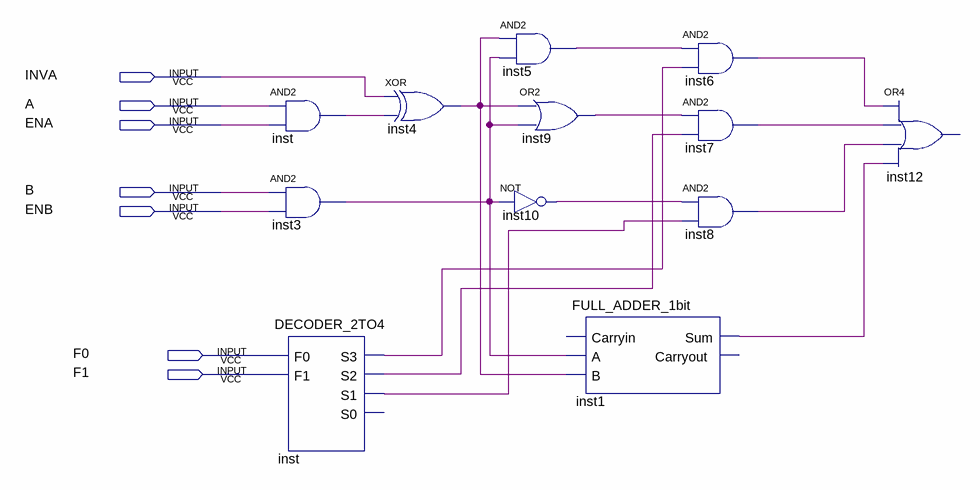
[diagram p0: schematic sheet]
// Quartus schematic ULA_1_BIT.bdf as structural Verilog: 12 symbols, 7 pins
module ULA_1_BIT (
  input  INVA,
  input  A,
  input  ENA,
  input  B,
  input  ENB,
  input  F0,
  input  F1
);

  wire inst1_sum, inst3_out, inst4_out, inst5_out, inst6_out, inst7_out, inst8_out, inst9_out, inst10_out,
       inst_out, inst_s1, inst_s2, inst_s3;

  and inst (inst_out, A, ENA);
  and inst3 (inst3_out, B, ENB);
  DECODER_2TO4 inst_dup2 (.F0(F0), .F1(F1), .S3(inst_s3), .S2(inst_s2), .S1(inst_s1));  // open: S0
  xor inst4 (inst4_out, INVA, inst_out);
  and inst5 (inst5_out, inst4_out, inst3_out);
  or inst9 (inst9_out, inst4_out, inst3_out);
  not inst10 (inst10_out, inst3_out);
  FULL_ADDER_1bit inst1 (.A(inst3_out), .B(inst4_out), .Sum(inst1_sum));  // open: Carryin, Carryout
  and inst6 (inst6_out, inst5_out, inst_s3);
  and inst7 (inst7_out, inst9_out, inst_s2);
  and inst8 (inst8_out, inst10_out, inst_s1);
  // OR4 inst12 has open pins: IN1=inst6_out, IN2=inst7_out, IN3=inst8_out, IN4=inst1_sum, OUT=open
endmodule
